# EAGLE schematic WisBlock-IO-Template (EAGLE 9.6.2)
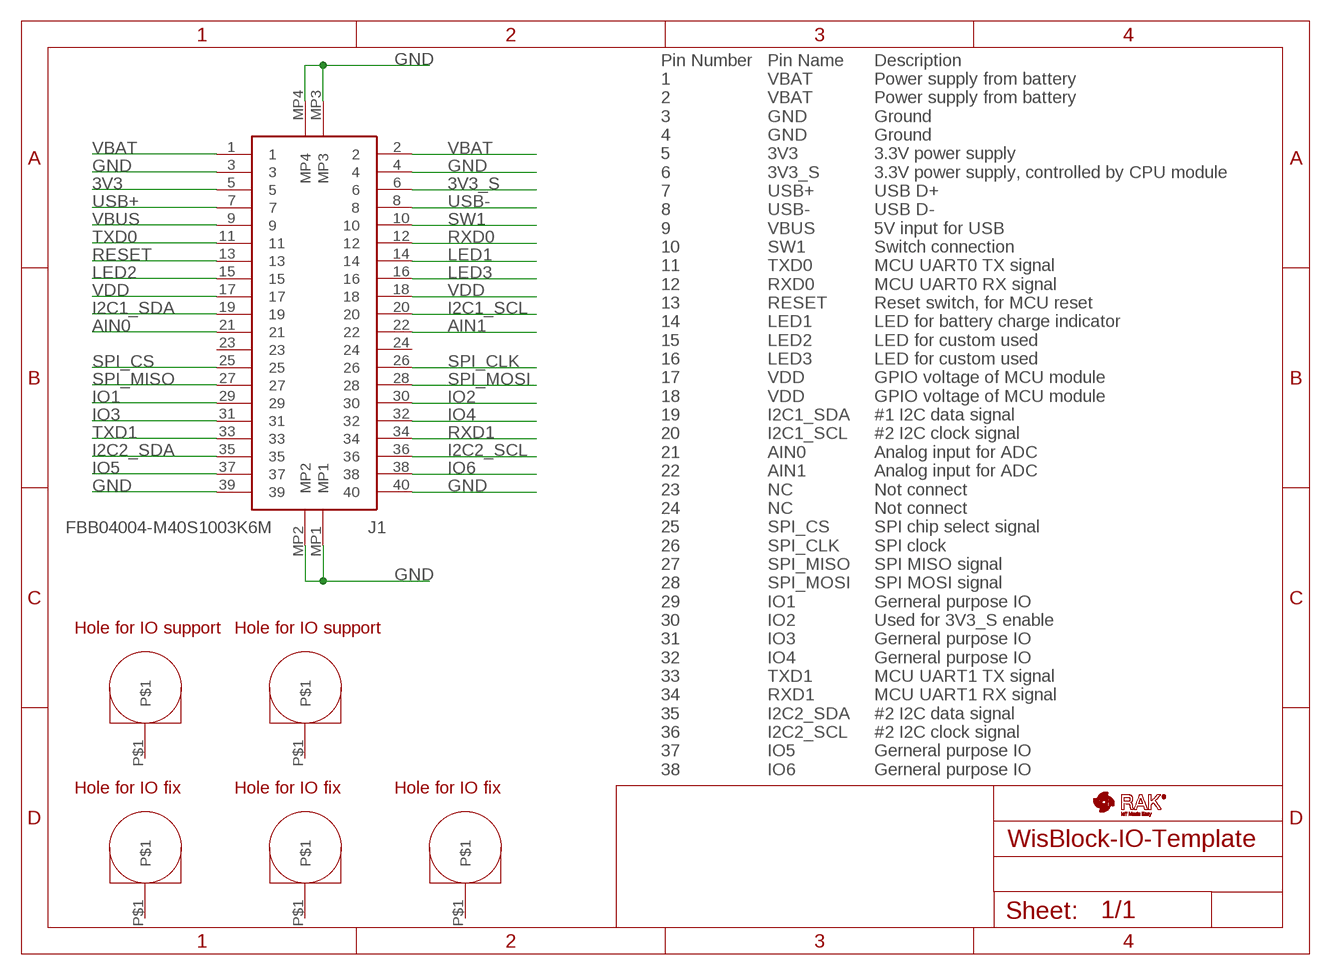
[diagram p0: schematic, sheet 1]

## Parts
J1  FBB04004-M40S1003K6M  [FBB04004M40S1003K6M]
U$1  RAK_LOGO  [WISBLOCK_LOGO]
U$2  RAK_IO_FIX_LARGE  [RAK_IO_FIX_LARGE]
U$3  RAK_IO_FIX_LARGE  [RAK_IO_FIX_LARGE]
U$4  RAK_IO_FIX_SMALL  [RAK_IO_FIX_SMALL]
U$5  RAK_IO_FIX_SMALL  [RAK_IO_FIX_SMALL]
U$6  RAK_IO_FIX_SMALL  [RAK_IO_FIX_SMALL]

## Nets
3V3: J1.5
3V3_S: J1.6
AIN0: J1.21
AIN1: J1.22
GND: J1.3 J1.4 J1.39 J1.40 J1.MP1 J1.MP2 J1.MP3 J1.MP4
I2C1_SCL: J1.20
I2C1_SDA: J1.19
I2C2_SCL: J1.36
I2C2_SDA: J1.35
IO1: J1.29
IO2: J1.30
IO3: J1.31
IO4: J1.32
IO5: J1.37
IO6: J1.38
LED1: J1.14
LED2: J1.15
LED3: J1.16
RESET: J1.13
RXD0: J1.12
RXD1: J1.34
SPI_CLK: J1.26
SPI_CS: J1.25
SPI_MISO: J1.27
SPI_MOSI: J1.28
SW1: J1.10
TXD0: J1.11
TXD1: J1.33
USB+: J1.7
USB-: J1.8
VBAT: J1.1 J1.2
VBUS: J1.9
VDD: J1.17 J1.18
Unconnected: J1.23 J1.24 U$2.P$1 U$3.P$1 U$4.P$1 U$5.P$1 U$6.P$1

## Notes on the sheet
- Pin Number 
  1 
  2 
  3 
  4 
  5 
  6 
  7 
  8 
  9 
  10 
  11 
  12 
  13 
  14 
  15 
  16 
  17 
  18 
  19 
  20 
  21 
  22 
  23 
  24 
  25 
  26 
  27 
  28 
  29 
  30 
  31 
  32 
  33 
  34 
  35 
  36 
  37 
  38
- Pin Name 
  VBAT 
  VBAT 
  GND 
  GND 
  3V3 
  3V3_S 
  USB+ 
  USB- 
  VBUS 
  SW1 
  TXD0 
  RXD0 
  RESET 
  LED1 
  LED2 
  LED3 
  VDD 
  VDD 
  I2C1_SDA 
  I2C1_SCL 
  AIN0 
  AIN1 
  NC 
  NC 
  SPI_CS 
  SPI_CLK 
  SPI_MISO 
  SPI_MOSI 
  IO1 
  IO2 
  IO3 
  IO4 
  TXD1 
  RXD1 
  I2C2_SDA 
  I2C2_SCL 
  IO5 
  IO6
- Description 
  Power supply from battery 
  Power supply from battery 
  Ground 
  Ground 
  3.3V power supply 
  3.3V power supply, controlled by CPU module 
  USB D+ 
  USB D- 
  5V input for USB 
  Switch connection 
  MCU UART0 TX signal 
  MCU UART0 RX signal 
  Reset switch, for MCU reset 
  LED for battery charge indicator 
  LED for custom used 
  LED for custom used 
  GPIO voltage of MCU module 
  GPIO voltage of MCU module 
  #1 I2C data signal 
  #2 I2C clock signal 
  Analog input for ADC 
  Analog input for ADC 
  Not connect 
  Not connect 
  SPI chip select signal 
  SPI clock 
  SPI MISO signal 
  SPI MOSI signal 
  Gerneral purpose IO 
  Used for 3V3_S enable 
  Gerneral purpose IO 
  Gerneral purpose IO 
  MCU UART1 TX signal 
  MCU UART1 RX signal 
  #2 I2C data signal 
  #2 I2C clock signal 
  Gerneral purpose IO 
  Gerneral purpose IO

## Library data of the parts
J1 = FBB04004-M40S1003K6M:FBB04004-M40S1003K6M: Mezzanine Connectors (Board to Board) SMD RoHS 40 Pos Source: Datasheet <https://tupian.txga.com/serials-attach/FBB04004-M/Drawing-FBB04004-M.pdf>; ARROW_PART_NUMBER: FBB04004-M40S1003K6M; DESCRIPTION: Mezzanine Connectors (Board to Board) SMD RoHS 40 Pos; HEIGHT: 0.95mm; MANUFACTURER_NAME: TXGA; MANUFACTURER_PART_NUMBER: FBB04004-M40S1003K6M
U$1 = WisBlock-Template:RAK_LOGO
U$2 U$3 = WisBlock:RAK_IO_FIX_LARGE
U$4-U$6 = WisBlock:RAK_IO_FIX_SMALL